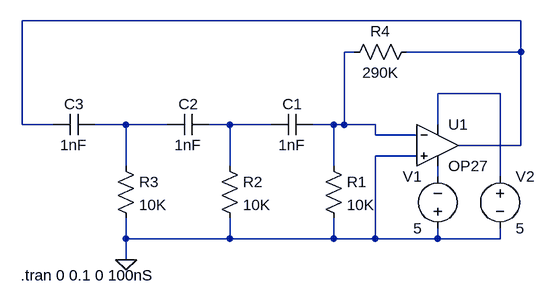
[diagram p0: schematic osc_phase_shift.asc]
osc_phase_shift.asc, the LTspice schematic file:
Version 4
SHEET 1 880 680
WIRE 560 -80 -208 -80
WIRE 304 -32 288 -32
WIRE 560 -32 560 -80
WIRE 560 -32 384 -32
WIRE 528 32 432 32
WIRE -208 80 -208 -80
WIRE -160 80 -208 80
WIRE -48 80 -96 80
WIRE 16 80 -48 80
WIRE 112 80 80 80
WIRE 176 80 112 80
WIRE 272 80 240 80
WIRE 288 80 288 -32
WIRE 288 80 272 80
WIRE 336 80 288 80
WIRE 432 80 432 32
WIRE 336 96 336 80
WIRE 400 96 336 96
WIRE 560 112 560 -32
WIRE 560 112 464 112
WIRE 400 128 336 128
WIRE -48 144 -48 80
WIRE 112 144 112 80
WIRE 272 144 272 80
WIRE 432 160 432 144
WIRE 528 160 528 32
WIRE -48 256 -48 224
WIRE 112 256 112 224
WIRE 112 256 -48 256
WIRE 272 256 272 224
WIRE 272 256 112 256
WIRE 336 256 336 128
WIRE 336 256 272 256
WIRE 432 256 432 240
WIRE 432 256 336 256
WIRE 528 256 528 240
WIRE 528 256 432 256
WIRE -48 288 -48 256
FLAG -48 288 0
SYMBOL Opamps\\OP27 432 48 R0
SYMATTR InstName U1
SYMBOL res 256 128 R0
SYMATTR InstName R1
SYMATTR Value 10K
SYMBOL res 96 128 R0
SYMATTR InstName R2
SYMATTR Value 10K
SYMBOL res -64 128 R0
SYMATTR InstName R3
SYMATTR Value 10K
SYMBOL cap 240 64 R90
WINDOW 0 0 32 VBottom 2
WINDOW 3 32 32 VTop 2
SYMATTR InstName C1
SYMATTR Value 1nF
SYMBOL cap 80 64 R90
WINDOW 0 0 32 VBottom 2
WINDOW 3 32 32 VTop 2
SYMATTR InstName C2
SYMATTR Value 1nF
SYMBOL cap -96 64 R90
WINDOW 0 0 32 VBottom 2
WINDOW 3 32 32 VTop 2
SYMATTR InstName C3
SYMATTR Value 1nF
SYMBOL res 400 -48 R90
WINDOW 0 0 56 VBottom 2
WINDOW 3 32 56 VTop 2
SYMATTR InstName R4
SYMATTR Value 290K
SYMBOL voltage 432 256 R180
WINDOW 0 24 96 Left 2
WINDOW 3 24 16 Left 2
WINDOW 123 0 0 Left 2
WINDOW 39 0 0 Left 2
SYMATTR InstName V1
SYMATTR Value 5
SYMBOL voltage 528 144 R0
WINDOW 123 0 0 Left 2
WINDOW 39 0 0 Left 2
SYMATTR InstName V2
SYMATTR Value 5
TEXT -210 312 Left 2 !.tran 0 0.1 0 100nS

The netlist it stands for:
* osc_phase_shift.asc
XU1 0 N002 N003 N006 N001 OP27  ; pins In+ In- V+ V- OUT
R1 N002 0 10K
R2 N005 0 10K
R3 N004 0 10K
C1 N002 N005 1nF
C2 N005 N004 1nF
C3 N004 N001 1nF
R4 N001 N002 290K
V1 0 N006 5
V2 N003 0 5
.tran 0 0.1 0 100nS
.lib ADI.lib
.backanno
.end